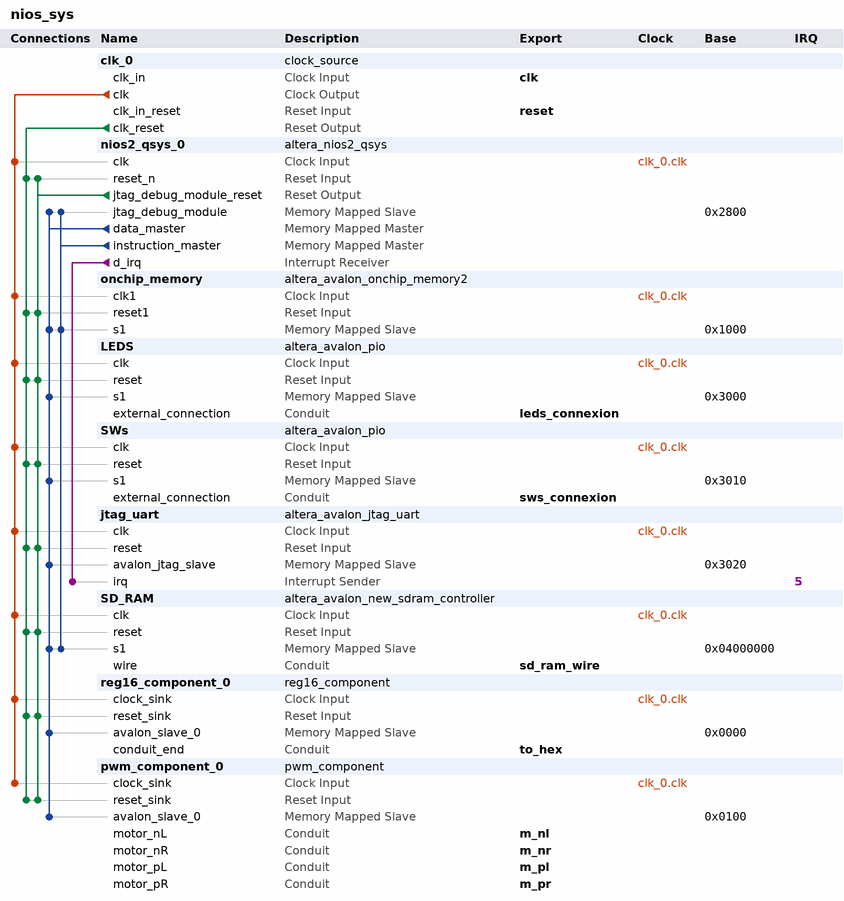
[diagram p0: system contents]
# Platform Designer (Qsys) system nios_sys, Cyclone IV E EP4CE22F17C6
# Parameters at their usual value, and those the tool derives, are not listed.
package require -exact qsys 13.0.1.99.2
create_system nios_sys
set_project_property DEVICE_FAMILY {Cyclone IV E}
set_project_property DEVICE EP4CE22F17C6

add_instance clk_0 clock_source 13.0
set_instance_parameter_value clk_0 clockFrequency 50000000

add_instance nios2_qsys_0 altera_nios2_qsys 13.0
set_instance_parameter_value nios2_qsys_0 resetSlave SD_RAM.s1
set_instance_parameter_value nios2_qsys_0 mmu_TLBMissExcSlave None
set_instance_parameter_value nios2_qsys_0 exceptionSlave SD_RAM.s1
set_instance_parameter_value nios2_qsys_0 breakSlave nios2_qsys_0.jtag_debug_module
set_instance_parameter_value nios2_qsys_0 impl Tiny
set_instance_parameter_value nios2_qsys_0 icache_size 4096

add_instance onchip_memory altera_avalon_onchip_memory2 13.0.1.99.2
set_instance_parameter_value onchip_memory dataWidth 32
set_instance_parameter_value onchip_memory dualPort false
set_instance_parameter_value onchip_memory initMemContent true
set_instance_parameter_value onchip_memory initializationFileName onchip_mem.hex
set_instance_parameter_value onchip_memory memorySize 4096

add_instance LEDS altera_avalon_pio 13.0.1.99.2
set_instance_parameter_value LEDS direction Output
set_instance_parameter_value LEDS width 8

add_instance SWs altera_avalon_pio 13.0.1.99.2
set_instance_parameter_value SWs direction Input
set_instance_parameter_value SWs width 4

add_instance jtag_uart altera_avalon_jtag_uart 13.0.1.99.2
set_instance_parameter_value jtag_uart simInteractiveOptions NO_INTERACTIVE_WINDOWS

add_instance SD_RAM altera_avalon_new_sdram_controller 13.0.1.99.2
set_instance_parameter_value SD_RAM TAC 5.5
set_instance_parameter_value SD_RAM TRCD 20.0
set_instance_parameter_value SD_RAM TRP 20.0
set_instance_parameter_value SD_RAM casLatency 3
set_instance_parameter_value SD_RAM columnWidth 9
set_instance_parameter_value SD_RAM dataWidth 16
set_instance_parameter_value SD_RAM generateSimulationModel false
set_instance_parameter_value SD_RAM model single_Micron_MT48LC4M32B2_7_chip
set_instance_parameter_value SD_RAM numberOfBanks 4
set_instance_parameter_value SD_RAM numberOfChipSelects 1
set_instance_parameter_value SD_RAM powerUpDelay 100.0
set_instance_parameter_value SD_RAM refreshPeriod 15.625
set_instance_parameter_value SD_RAM rowWidth 13

add_instance reg16_component_0 reg16_component 1.0

add_instance pwm_component_0 pwm_component 1.0

# connections
add_connection clk_0.clk jtag_uart.clk clock
add_connection clk_0.clk LEDS.clk clock
add_connection clk_0.clk nios2_qsys_0.clk clock
add_connection clk_0.clk onchip_memory.clk1 clock
add_connection clk_0.clk pwm_component_0.clock_sink clock
add_connection clk_0.clk reg16_component_0.clock_sink clock
add_connection clk_0.clk SD_RAM.clk clock
add_connection clk_0.clk SWs.clk clock
add_connection clk_0.clk_reset jtag_uart.reset reset
add_connection clk_0.clk_reset LEDS.reset reset
add_connection clk_0.clk_reset nios2_qsys_0.reset_n reset
add_connection clk_0.clk_reset onchip_memory.reset1 reset
add_connection clk_0.clk_reset pwm_component_0.reset_sink reset
add_connection clk_0.clk_reset reg16_component_0.reset_sink reset
add_connection clk_0.clk_reset SD_RAM.reset reset
add_connection clk_0.clk_reset SWs.reset reset
add_connection nios2_qsys_0.jtag_debug_module_reset jtag_uart.reset reset
add_connection nios2_qsys_0.jtag_debug_module_reset LEDS.reset reset
add_connection nios2_qsys_0.jtag_debug_module_reset nios2_qsys_0.reset_n reset
add_connection nios2_qsys_0.jtag_debug_module_reset onchip_memory.reset1 reset
add_connection nios2_qsys_0.jtag_debug_module_reset pwm_component_0.reset_sink reset
add_connection nios2_qsys_0.jtag_debug_module_reset reg16_component_0.reset_sink reset
add_connection nios2_qsys_0.jtag_debug_module_reset SD_RAM.reset reset
add_connection nios2_qsys_0.jtag_debug_module_reset SWs.reset reset
add_connection nios2_qsys_0.data_master jtag_uart.avalon_jtag_slave avalon
set_connection_parameter_value nios2_qsys_0.data_master/jtag_uart.avalon_jtag_slave baseAddress 0x3020
add_connection nios2_qsys_0.data_master LEDS.s1 avalon
set_connection_parameter_value nios2_qsys_0.data_master/LEDS.s1 baseAddress 0x3000
add_connection nios2_qsys_0.data_master nios2_qsys_0.jtag_debug_module avalon
set_connection_parameter_value nios2_qsys_0.data_master/nios2_qsys_0.jtag_debug_module baseAddress 0x2800
add_connection nios2_qsys_0.data_master onchip_memory.s1 avalon
set_connection_parameter_value nios2_qsys_0.data_master/onchip_memory.s1 baseAddress 0x1000
add_connection nios2_qsys_0.data_master pwm_component_0.avalon_slave_0 avalon
set_connection_parameter_value nios2_qsys_0.data_master/pwm_component_0.avalon_slave_0 baseAddress 0x0100
add_connection nios2_qsys_0.data_master reg16_component_0.avalon_slave_0 avalon
set_connection_parameter_value nios2_qsys_0.data_master/reg16_component_0.avalon_slave_0 baseAddress 0x0000
add_connection nios2_qsys_0.data_master SD_RAM.s1 avalon
set_connection_parameter_value nios2_qsys_0.data_master/SD_RAM.s1 baseAddress 0x04000000
add_connection nios2_qsys_0.data_master SWs.s1 avalon
set_connection_parameter_value nios2_qsys_0.data_master/SWs.s1 baseAddress 0x3010
add_connection nios2_qsys_0.instruction_master nios2_qsys_0.jtag_debug_module avalon
set_connection_parameter_value nios2_qsys_0.instruction_master/nios2_qsys_0.jtag_debug_module baseAddress 0x2800
add_connection nios2_qsys_0.instruction_master onchip_memory.s1 avalon
set_connection_parameter_value nios2_qsys_0.instruction_master/onchip_memory.s1 baseAddress 0x1000
add_connection nios2_qsys_0.instruction_master SD_RAM.s1 avalon
set_connection_parameter_value nios2_qsys_0.instruction_master/SD_RAM.s1 baseAddress 0x04000000
add_connection nios2_qsys_0.d_irq jtag_uart.irq interrupt
set_connection_parameter_value nios2_qsys_0.d_irq/jtag_uart.irq irqNumber 5

# exported interfaces
add_interface clk clock sink
set_interface_property clk EXPORT_OF clk_0.clk_in
add_interface leds_connexion conduit end
set_interface_property leds_connexion EXPORT_OF LEDS.external_connection
add_interface sws_connexion conduit end
set_interface_property sws_connexion EXPORT_OF SWs.external_connection
add_interface reset reset sink
set_interface_property reset EXPORT_OF clk_0.clk_in_reset
add_interface sd_ram_wire conduit end
set_interface_property sd_ram_wire EXPORT_OF SD_RAM.wire
add_interface to_hex conduit end
set_interface_property to_hex EXPORT_OF reg16_component_0.conduit_end
add_interface m_nr conduit end
set_interface_property m_nr EXPORT_OF pwm_component_0.motor_nR
add_interface m_nl conduit end
set_interface_property m_nl EXPORT_OF pwm_component_0.motor_nL
add_interface m_pl conduit end
set_interface_property m_pl EXPORT_OF pwm_component_0.motor_pL
add_interface m_pr conduit end
set_interface_property m_pr EXPORT_OF pwm_component_0.motor_pR

set_interconnect_requirement {$system} qsys_mm.clockCrossingAdapter HANDSHAKE
set_interconnect_requirement {$system} qsys_mm.maxAdditionalLatency 1

save_system nios_sys.qsys
